# Altium project ControlBoard.PrjPCB (part 2 of 2)

## Sheet USB.SchDoc
size A
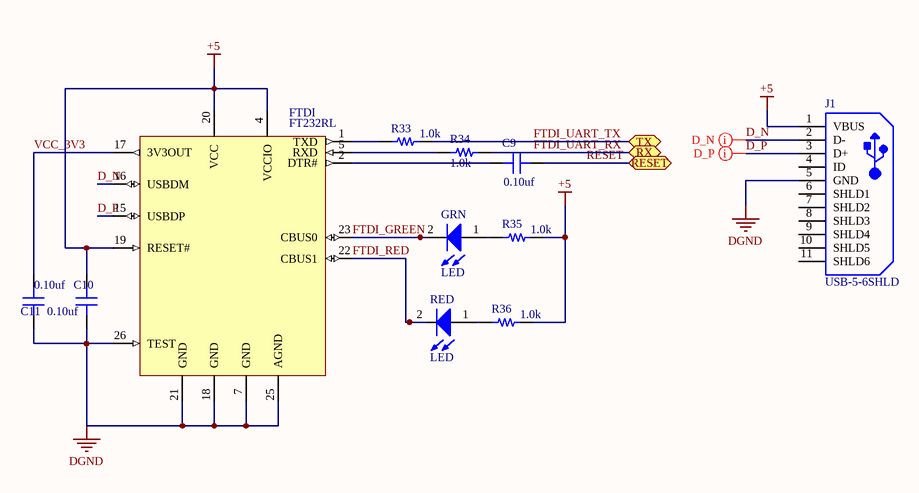
[diagram p10: USB.SchDoc]

### Parts
C9  value 0.10uf  [CAP 0603/1608]  (hidden comment: Capacitor MLCC 0.10uf 25V CAP 0603/1608)
C10  value 0.10uf  [CAP 0603/1608]  (hidden comment: Capacitor MLCC 0.10uf 25V CAP 0603/1608)
C11  value 0.10uf  [CAP 0603/1608]  (hidden comment: Capacitor MLCC 0.10uf 25V CAP 0603/1608)
FTDI  FT232RL  [SSOP-28]
GRN  LED  [0805_LED]
J1  USB-5-6SHLD  [TECO-1981568-5_V]
R33  value 1.0k  [RES 0805/2012]  (hidden comment: Resistor 1.0k 0805 1/4W 1%)
R34  value 1.0k  [RES 0805/2012]  (hidden comment: Resistor 1.0k 0805 1/4W 1%)
R35  value 1.0k  [RES 0805/2012]  (hidden comment: Resistor 1.0k 0805 1/4W 1%)
R36  value 1.0k  [RES 0805/2012]  (hidden comment: Resistor 1.0k 0805 1/4W 1%)
RED  LED  [0805_LED]

### Ports
RESET (bidir), RX (bidir), TX (bidir)

### Nets
+5: C10.2 FTDI.4(VCCIO) FTDI.19(RESET#) FTDI.20(VCC) J1.1(VBUS) R35.2 R36.2  [project net DVCC]
DGND: C10.1 C11.1 FTDI.7(GND) FTDI.18(GND) FTDI.21(GND) FTDI.25(AGND) FTDI.26(TEST) J1.5(GND)
D_N: FTDI.16(USBDM) J1.2(D-)
D_P: FTDI.15(USBDP) J1.3(D+)
FTDI_GREEN: FTDI.23(CBUS0) GRN.2(K)
FTDI_RED: FTDI.22(CBUS1) RED.2(K)
FTDI_UART_RX: R34.2 ; port RX
FTDI_UART_TX: R33.2 ; port TX
RESET: C9.2 ; port RESET
VCC_3V3: C11.2 FTDI.17(3V3OUT)
NetC9_1: C9.1 FTDI.2(DTR#)
NetFTDI_1: FTDI.1(TXD) R33.1
NetFTDI_5: FTDI.5(RXD) R34.1
NetGRN_1: GRN.1(A) R35.1
NetR36_1: R36.1 RED.1(A)

Not connected (* = marked no-connect by the designer): J1 4(ID) 6(SHLD1) 7(SHLD2) 8(SHLD3) 9(SHLD4) 10(SHLD5) 11(SHLD6)

### Layout directives
differential pair: D_N, D_P

### Library data of the parts
C9-C11 = 583: Manufacturer_id: 1; idCapacitor: 583; Name: Cap_0.10uf_25V_CAP 0603/1608; Dielectric: Ceramic; Created_By: Nick Mah; Drawer_id: 1; Voltage_Rating: 25V; Package: CAP 0603/1608; Created_Date: 10/20/2018
FTDI = 3: Manufacturer_id: 1; idIC_Interface: 3; Name: USB FTDI; Protocol: UART; Vin(Min): 3.3; Vin(Max): 5.25; Created_By: Kyle; Drawer_id: 1; MfrPartNo: FT232RL; Link: https://www.digikey.com/product-detail/en/ftdi-future-technology-devices-international-ltd/FT232RL-REEL/768-1007-1-ND/1836402
GRN = 2: Manufacturer_id: 1; idLED: 2; Name: LED_0805_GREEN; Value: Green; Brightness: 35mcd; Id: 20mA; Vf: 2V; Drawer_id: 1
J1 = 5: USB Micro Type B; Manufacturer_id: 1; MfrPartNo: 1981568-1; idConn: 5; Name: TE USB Micro; Value: CONN; Created_By: Aiku; Drawer_id: 1; Num_Contacts: 5; Link: https://www.mouser.com/ProductDetail/TE-Connectivity-AMP/1981568-1?qs=sGAEpiMZZMulM8LPOQ%252bykzEIUPbUCiSfqsfxH3Oq%252bYo%3d; ComponentLink1Description: Datasheet; Supplier1: TE; Created_Date: 10/20/2018
R33-R36 = 721: Manufacturer_id: 1; idResistor: 721; Name: Res_1.0k_0805_1/4W_1%; Created_By: Nick Mah; Supplier 1: Digi-Key; Drawer_id: 1; Tolerance: 1%; Power: 1/4W; Package: 0805; ComponentLink1Description: Datasheet; Created_Date: 2018-10-20
RED = 1: idLED: 1; Name: LED_0805_RED; Value: Red; Vf: 0.7V; Manufacturer_id: 1; Drawer_id: 1

## Sheet CAN_Tranceiver.SchDoc
size A
Used 2 times, as channels MCU_MKE185F512VLH16/MC, MCU_MKE185F512VLH16/GEN. Parts and nets are listed once, with the designators drawn on the sheet.
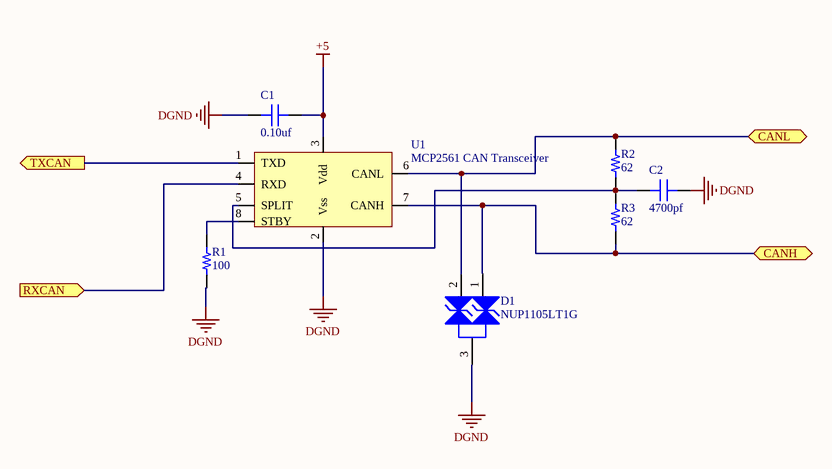
[diagram p11: CAN_Tranceiver.SchDoc]

### Parts
C1  value 0.10uf  [CAP 0603/1608]  (hidden comment: Capacitor MLCC 0.10uf 50V CAP 0603/1608)
C2  value 4700pf  [CAP 0603/1608]  (hidden comment: Capacitor MLCC 4700pf 50V CAP 0603/1608)
D1  NUP1105LT1G  [SOT-23 (TO-236)]
R1  value 100  [RES 0603/1608]  (hidden comment: Resistor 100 0603 1/10W 10%)
R2  value 62  [RES 0603/1608]  (hidden comment: Resistor 62 0603 1/10W 5%)
R3  value 62  [RES 0603/1608]  (hidden comment: Resistor 62 0603 1/10W 5%)
U1  MCP2561 CAN Transceiver  [SOIC-8]

### Ports
CANH (bidir), CANL (bidir), RXCAN (in), TXCAN (out)

### Nets
+5: C1.2 U1.3(Vdd)
DGND: C1.1 C2.1 D1.3(K) R1.1 U1.2(Vss)
CANH: D1.1(K) R3.2 U1.7(CANH) ; port CANH
CANL: D1.2(K) R2.1 U1.6(CANL) ; port CANL
RXCAN: U1.4(RXD) ; port RXCAN
TXCAN: U1.1(TXD) ; port TXCAN
NetC2_2: C2.2 R2.2 R3.1 U1.5(SPLIT)
NetR1_2: R1.2 U1.8(STBY)

### Channels
MCU_MKE185F512VLH16/MC: designators end in _M; ports CANH=CAN_GEN_H CANL=CAN_GEN_L RXCAN=MC_RX TXCAN=MC_TX
MCU_MKE185F512VLH16/GEN: designators end in _G; ports CANH=CAN_MC_H CANL=CAN_MC_L RXCAN=GEN_RX TXCAN=GEN_TX

### Library data of the parts
C1 = 943: Manufacturer_id: 1; idCapacitor: 943; Name: Cap_0.10uf_50V_CAP 0603/1608; Dielectric: Ceramic; Created_By: Nick Mah; Drawer_id: 1; Voltage_Rating: 50V; Package: CAP 0603/1608; Created_Date: 10/20/2018
C2 = 929: Manufacturer_id: 1; idCapacitor: 929; Name: Cap_4700pf_50V_CAP 0603/1608; Dielectric: Ceramic; Created_By: Nick Mah; Drawer_id: 1; Voltage_Rating: 50V; Package: CAP 0603/1608; Created_Date: 10/20/2018
D1 = 7: ESD Protection Diode; Manufacturer_id: 1; idDiode: 7; Name: SOT-23_350W_Zener; Value: TVS_24V; Type: Zener; Ic: 8A; Power: 350W; Drawer_id: 1; Num_Circuits: 1; Package: SOT-23; MfrPartNo: NUP1105LT1G; Link: https://www.digikey.com/product-detail/en/on-semiconductor/NUP1105LT1G/NUP1105LT1GOSCT-ND/2122067; ComponentLink1URL: https://www.digikey.com/product-detail/en/on-semiconductor/NUP1105LT1G/NUP1105LT1GOSCT-ND/2122067; Supplier1: Digikey; Supplier1PartNo: NUP1105LT1GOSCT-ND
R1 = 2293: Manufacturer_id: 1; idResistor: 2293; Name: Res_100_0603_1/10W_10%; Created_By: Nick Mah; Supplier 1: Digi-Key; Drawer_id: 1; Tolerance: 10%; Power: 1/10W; Package: 0603; ComponentLink1Description: Datasheet; Created_Date: 2018-10-20
R2 R3 = 1340: Manufacturer_id: 1; idResistor: 1340; Name: Res_62_0603_1/10W_5%; Created_By: Nick Mah; Supplier 1: Digi-Key; Drawer_id: 1; Tolerance: 5%; Power: 1/10W; Package: 0603; ComponentLink1Description: Datasheet; Created_Date: 2018-10-20
U1 = 5: Manufacturer_id: 1; idIC_Interface: 5; Value: CAN/UART; Data_Rate: 1Mbps; Vin(Min): 4.5V; Vin(Max): 5.5V; Created_By: Angel Delgado; Drawer_id: 1; Name: CAN Transceiver; Type: Transceiver; Protocol: CAN; Num_Circuits: 1; Package: SOIC-8; MfrPartNo: MCP2561; Link: https://www.digikey.com/product-detail/en/microchip-technology/MCP2561T-E-SN/MCP2561T-E-SNCT-ND/5148846

## Nets that join several sheets
+12: 12V_out_driver (27 pins), Connector (X1.B22), RVP_OVP_HC (5 pins), Shutdown (11 pins), LDO_5V (C3.2 U8.3)
AGND: ControlBoard_Top (N1.2), Connector (8 pins), BSPD (31 pins), MCU_MKE185F512VLH16 (C7.1 MCU.10)
DGND: ControlBoard_Top (N1.1), 5V_out_driver (18 pins), 12V_out_driver (21 pins), Connector (11 pins), RVP_OVP_HC (7 pins), Shutdown (16 pins), LDO_5V (C3.1 C4.1 U8.1), MC_power_en (R29.1), MCU_MKE185F512VLH16 (7 pins), USB (8 pins), MCU_MKE185F512VLH16/MC (5 pins), MCU_MKE185F512VLH16/GEN (5 pins)
DVCC: 5V_out_driver (20 pins), Connector (X1.A7 X1.B19), BSPD (24 pins), LDO_5V (C4.2 U8.2 U8.THM), MC_power_en (MC_PWR_SWITCH.2), MCU_MKE185F512VLH16 (10 pins), USB (7 pins), MCU_MKE185F512VLH16/MC (C1_M.2 U1_M.3), MCU_MKE185F512VLH16/GEN (C1_G.2 U1_G.3)
1: Connector (R14.2 X1.B1), BSPD (X3.1), MCU_MKE185F512VLH16 (MCU.32)
3: Connector (R20.2 X1.A34), MCU_MKE185F512VLH16 (MCU.28)
4: Connector (R22.2 X1.A25), MCU_MKE185F512VLH16 (MCU.27)
5: Connector (R13.1 X1.A9), BSPD (U3.1 U5.1 U5.4), MCU_MKE185F512VLH16 (MCU.31)
6: Connector (R16.1 X1.A17), BSPD (U3.3 U6.1 U6.4), MCU_MKE185F512VLH16 (MCU.30)
7: Connector (R23.1 X1.A8), MCU_MKE185F512VLH16 (MCU.29)
8: Connector (R19.1 X1.A16), MCU_MKE185F512VLH16 (MCU.23)
9: Connector (R21.1 X1.A15), MCU_MKE185F512VLH16 (MCU.24)
10: Connector (R24.1 X1.A14), MCU_MKE185F512VLH16 (MCU.22)
AIR+_5V: 12V_out_driver (TP27.1 U12.5), MCU_MKE185F512VLH16 (MCU.34)
AIR+_12V: 12V_out_driver (R48.2 TP28.1 U12.17), Connector (X1.B14)
AIR-_5V: 12V_out_driver (TP29.1 U12.7), MCU_MKE185F512VLH16 (MCU.35)
AIR-_12V: 12V_out_driver (R49.2 TP30.1 U12.14), Connector (X1.B11)
BMS_OK: 5V_out_driver (TP19.1 U11.5), Connector (R15.1 X1.B9), Shutdown (X5.1)
BMS_OK_5V: 5V_out_driver (R44.2 TP20.1 U11.17), MCU_MKE185F512VLH16 (MCU.13)
BRK_LIGHT_OUT: 12V_out_driver (R47.2 TP26.1 U12.18), Connector (X1.A18)
BRK_LIT_5V: 12V_out_driver (TP25.1 U12.3), MCU_MKE185F512VLH16 (MCU.33)
BSPD_OK_5V: 12V_out_driver (TP43.1 U14.7), BSPD (D8.1 X2.2), MCU_MKE185F512VLH16 (MCU.36)
BSPD_OK_12V: 12V_out_driver (R56.2 TP44.1 U14.14), Connector (X1.A11), Shutdown (X4.1)
CAN_GEN_H: Connector (X1.A5), MCU_MKE185F512VLH16/MC (D1_M.1 R3_M.2 U1_M.7)
CAN_GEN_L: Connector (X1.A4), MCU_MKE185F512VLH16/MC (D1_M.2 R2_M.1 U1_M.6)
CAN_MC_H: Connector (X1.B3), MCU_MKE185F512VLH16/GEN (D1_G.1 R3_G.2 U1_G.7)
CAN_MC_L: Connector (X1.B2), MCU_MKE185F512VLH16/GEN (D1_G.2 R2_G.1 U1_G.6)
DCDC_DIS_5V: 12V_out_driver (TP37.1 U13.9), MCU_MKE185F512VLH16 (MCU.45)
DCDC_DIS_12V: 12V_out_driver (R53.2 TP38.1 U13.13), Connector (X1.B4)
DSCHRG_5V: 12V_out_driver (TP33.1 U13.5), MCU_MKE185F512VLH16 (MCU.43)
DSCHRG_12V: 12V_out_driver (R51.2 TP34.1 U13.17), Connector (X1.B13)
FAN_EN: 5V_out_driver (TP7.1 U9.3), MCU_MKE185F512VLH16 (MCU.2)
FAN_EN_OUT: 5V_out_driver (R39.2 TP8.1 U9.5), Connector (X1.A12)
FAN_PWM: 5V_out_driver (TP5.1 U9.1), MCU_MKE185F512VLH16 (MCU.1)
FAN_PWM_OUT: 5V_out_driver (R57.2 TP6.1 U9.7), Connector (X1.A10)
FTDI_UART_RX: MCU_MKE185F512VLH16 (MCU.47), USB (R34.2)
FTDI_UART_TX: MCU_MKE185F512VLH16 (MCU.48), USB (R33.2)
GEN1_OUT: 12V_out_driver (R61.2 TP46.1 U12.13), Connector (X1.A19)
GEN2_OUT: 12V_out_driver (R62.2 TP48.1 U14.13), Connector (X1.A33)
GEN_PURP_1_5V: 12V_out_driver (TP45.1 U12.9), MCU_MKE185F512VLH16 (MCU.37)
GEN_PURP_2_5V: 12V_out_driver (TP47.1 U14.9), MCU_MKE185F512VLH16 (MCU.46)
GEN_RX: MCU_MKE185F512VLH16 (MCU.52 TP4.1), MCU_MKE185F512VLH16/GEN (U1_G.4)
GEN_TX: MCU_MKE185F512VLH16 (MCU.51 TP3.1), MCU_MKE185F512VLH16/GEN (U1_G.1)
IMD_OK: 5V_out_driver (TP17.1 U11.3), Connector (R12.1 X1.B21), Shutdown (X6.1)
IMD_OK_5V: 5V_out_driver (R43.1 TP18.1 U11.18), MCU_MKE185F512VLH16 (MCU.14)
LATCH_SENSE_OUT: 5V_out_driver (R42.2 TP12.1 U10.18), MCU_MKE185F512VLH16 (MCU.49)
LTCH_BTN_IN: Connector (X1.A1), Shutdown (LATCH_RELAY.4 LATCH_RELAY.8 Y4.COM)
LTCH_BTN_OUT: Connector (X1.A2), Shutdown (LATCH_RELAY.3 Y3.NO)
LTCH_LED_12V: 5V_out_driver (TP11.1 U10.3), Connector (X1.A26), Shutdown (LATCH_RELAY.2)
MC_EN: 5V_out_driver (TP13.1 U10.5), Connector (R18.1 X1.A3)
MC_EN_5V: 5V_out_driver (R40.2 TP14.1 U10.17), MCU_MKE185F512VLH16 (MCU.53)
MC_PWR: Connector (X1.A21), MC_power_en (MC_PWR_SWITCH.1 R29.2)
MC_RX: MCU_MKE185F512VLH16 (MCU.6 TP1.1), MCU_MKE185F512VLH16/MC (U1_M.4)
MC_TX: MCU_MKE185F512VLH16 (MCU.5 TP2.1), MCU_MKE185F512VLH16/MC (U1_M.1)
MCU_REDUN_1_OUT: 12V_out_driver (R54.2 TP40.1 U14.18), Shutdown (X7.1)
MCU_REDUN_2_OUT: 12V_out_driver (R55.2 TP42.1 U14.17), Shutdown (X8.1)
PRCHRG_5V: 12V_out_driver (TP31.1 U13.3), MCU_MKE185F512VLH16 (MCU.42)
PRCHRG_12V: 12V_out_driver (R50.2 TP32.1 U13.18), Connector (X1.B12)
PUMP_EN: 5V_out_driver (TP9.1 U9.6), MCU_MKE185F512VLH16 (MCU.3)
PUMP_EN_OUT: 5V_out_driver (R58.2 TP10.1 U9.2), Connector (X1.A13)
PWR: Connector (X1.A28 X1.A29 X1.A30), RVP_OVP_HC (PTC_Fuse.1)
REDUN_1_MCU: 12V_out_driver (TP39.1 U14.3), MCU_MKE185F512VLH16 (MCU.39)
REDUN_2_MCU: 12V_out_driver (TP41.1 U14.5), MCU_MKE185F512VLH16 (MCU.38)
RESET: MCU_MKE185F512VLH16 (FLASH.10 MCU.63), USB (C9.2)
RTDS_5V: 12V_out_driver (TP35.1 U13.7), MCU_MKE185F512VLH16 (MCU.44)
RTDS_12V: 12V_out_driver (R52.2 TP36.1 U13.14), Connector (X1.A32)
TS_LIVE_5V: 5V_out_driver (R46.2 TP24.1 U11.13), MCU_MKE185F512VLH16 (MCU.11)
TS_LIVE_12V: 5V_out_driver (TP23.1 U11.9), Connector (X1.B7)
TS_RDY_5V: 5V_out_driver (R41.2 TP16.1 U10.14), MCU_MKE185F512VLH16 (MCU.54)
TS_RDY_12V: 5V_out_driver (TP15.1 U10.7), Connector (X1.A27), Shutdown (LATCH_RELAY.6)
TS_RDY_SNS: 5V_out_driver (TP21.1 U11.7), Connector (X1.B5)
TS_RDY_SNS_OUT: 5V_out_driver (R45.2 TP22.1 U11.14), MCU_MKE185F512VLH16 (MCU.12)